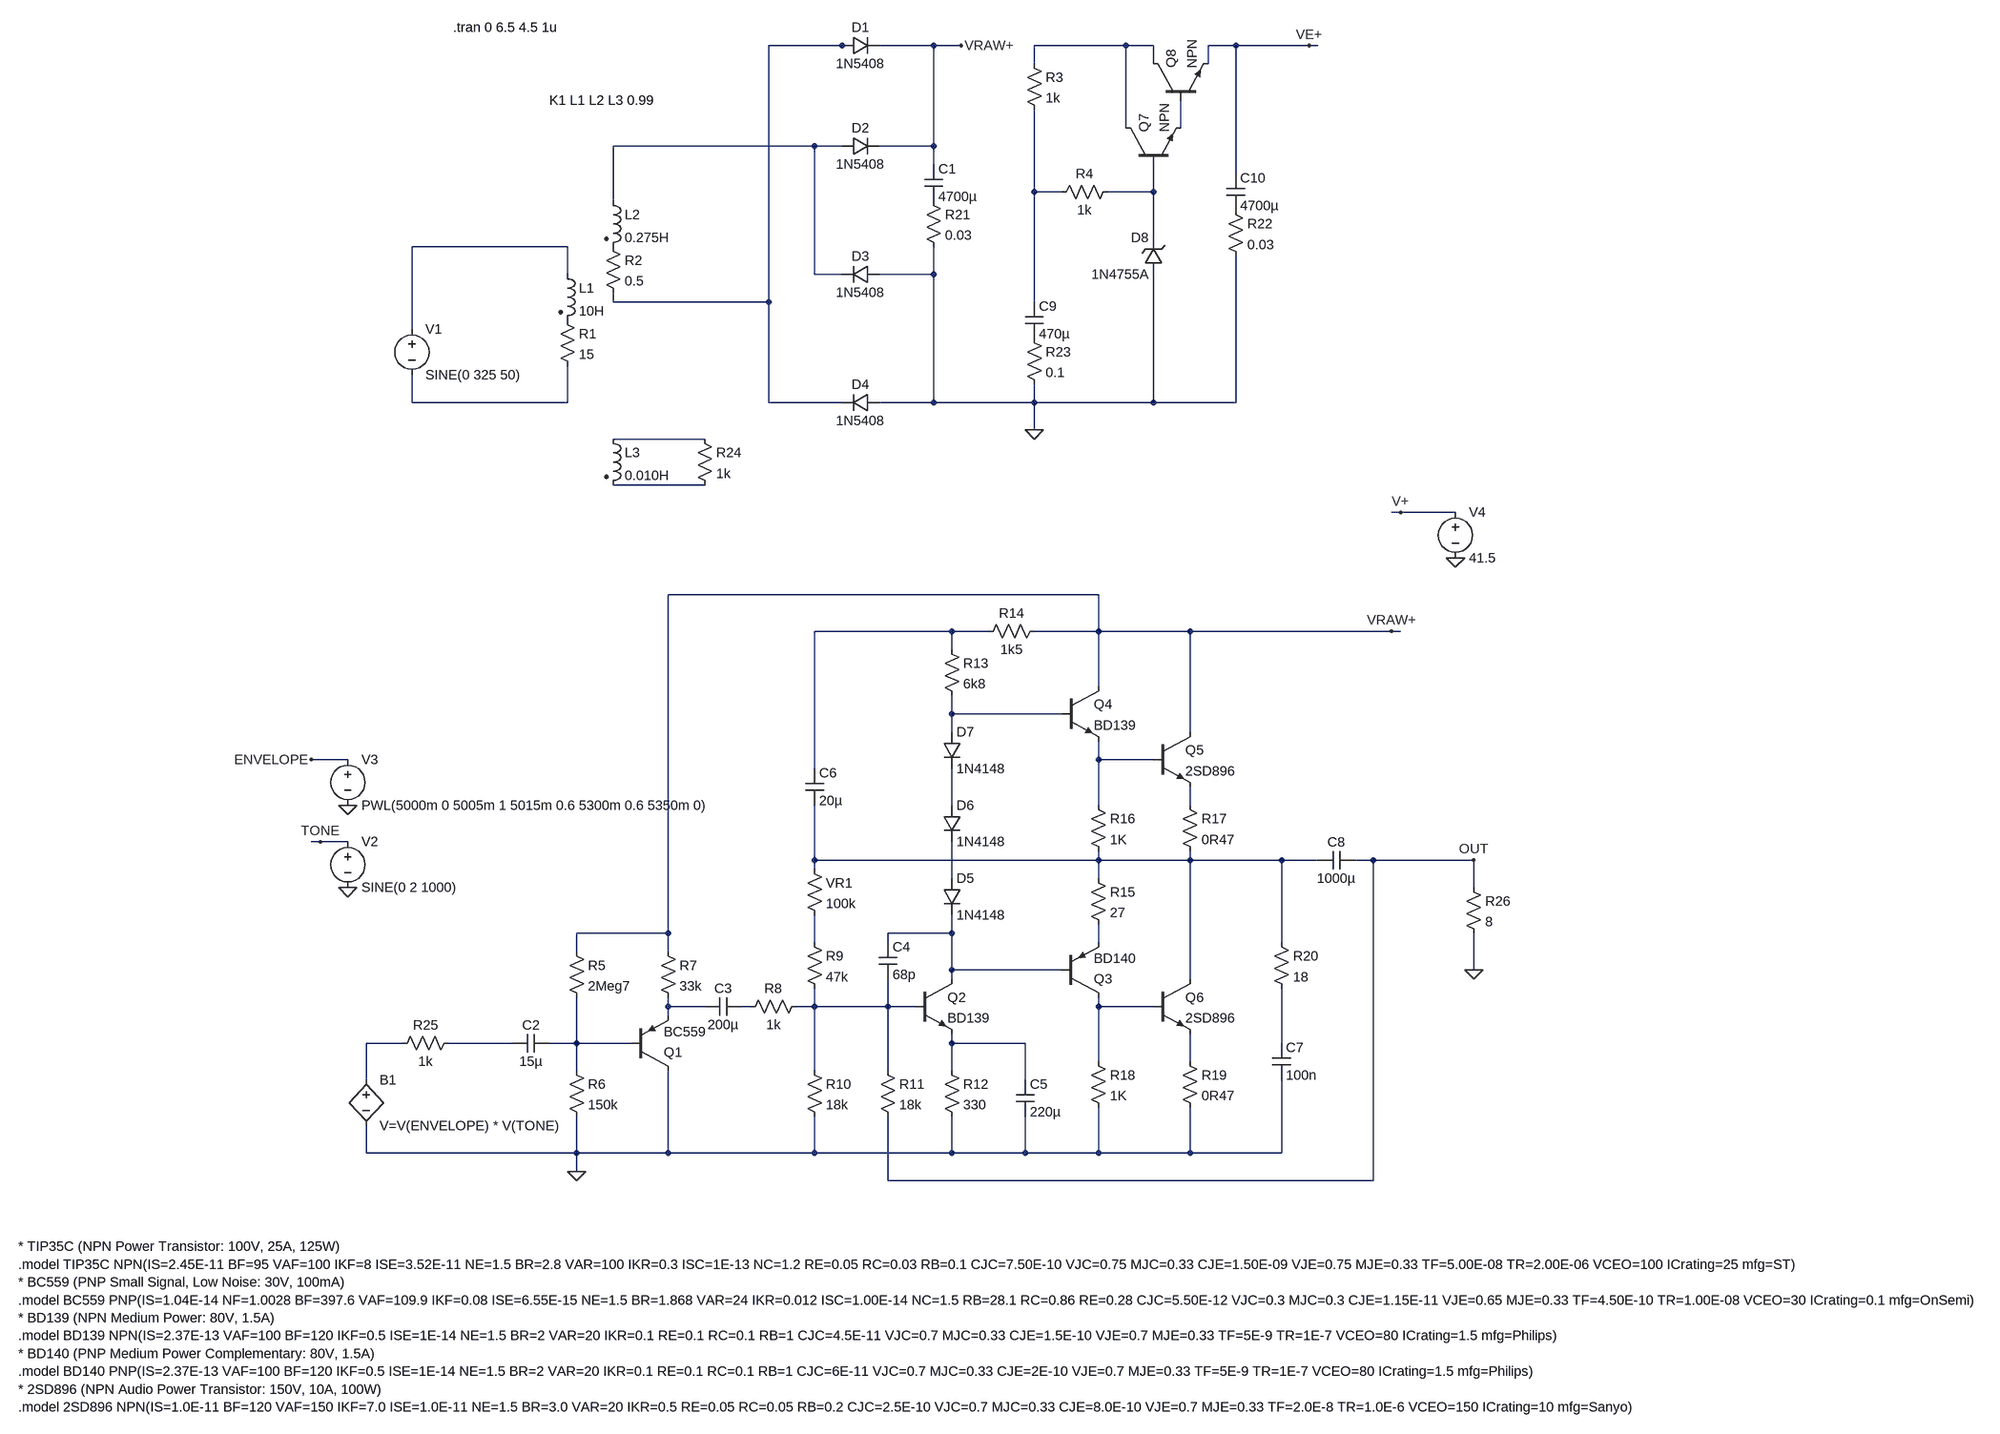
[diagram p0: schematic el_cheapo.asc]
el_cheapo.asc, the LTspice schematic file:
Version 4
SHEET 1 2784 2188
WIRE 832 -240 704 -240
WIRE 848 -240 832 -240
WIRE 992 -240 896 -240
WIRE 1040 -240 992 -240
WIRE 1328 -240 1168 -240
WIRE 1376 -240 1328 -240
WIRE 1520 -240 1472 -240
WIRE 1648 -240 1520 -240
WIRE 1664 -240 1648 -240
WIRE 1168 -208 1168 -240
WIRE 1376 -208 1376 -240
WIRE 1472 -208 1472 -240
WIRE 1328 -96 1328 -240
WIRE 1424 -96 1424 -144
WIRE 784 -64 432 -64
WIRE 832 -64 784 -64
WIRE 992 -64 992 -240
WIRE 992 -64 896 -64
WIRE 992 -32 992 -64
WIRE 1520 -16 1520 -240
WIRE 1168 16 1168 -128
WIRE 1216 16 1168 16
WIRE 1376 16 1376 -32
WIRE 1376 16 1296 16
WIRE 432 32 432 -64
WIRE 1376 96 1376 16
WIRE 352 112 80 112
WIRE 352 160 352 112
WIRE 784 160 784 -64
WIRE 832 160 784 160
WIRE 992 160 992 112
WIRE 992 160 896 160
WIRE 432 208 432 192
WIRE 704 208 704 -240
WIRE 704 208 432 208
WIRE 1168 208 1168 16
WIRE 80 256 80 112
WIRE 80 384 80 336
WIRE 352 384 352 320
WIRE 352 384 80 384
WIRE 704 384 704 208
WIRE 832 384 704 384
WIRE 992 384 992 160
WIRE 992 384 896 384
WIRE 1168 384 1168 352
WIRE 1168 384 992 384
WIRE 1376 384 1376 160
WIRE 1376 384 1168 384
WIRE 1520 384 1520 128
WIRE 1520 384 1376 384
WIRE 1168 432 1168 384
WIRE 592 448 432 448
WIRE 592 528 432 528
WIRE 1808 576 1792 576
WIRE 1904 576 1808 576
WIRE 1280 720 528 720
WIRE 1024 784 784 784
WIRE 1088 784 1024 784
WIRE 1280 784 1280 720
WIRE 1280 784 1168 784
WIRE 1440 784 1280 784
WIRE 1792 784 1440 784
WIRE 1808 784 1792 784
WIRE 1024 816 1024 784
WIRE 1280 880 1280 784
WIRE 1024 928 1024 896
WIRE 1216 928 1024 928
WIRE 1024 960 1024 928
WIRE 1440 960 1440 784
WIRE -32 1008 -96 1008
WIRE 1280 1008 1280 976
WIRE 1376 1008 1280 1008
WIRE 784 1024 784 784
WIRE 1024 1088 1024 1024
WIRE 1280 1088 1280 1008
WIRE 1440 1088 1440 1056
WIRE -80 1152 -96 1152
WIRE -32 1152 -80 1152
WIRE 784 1184 784 1088
WIRE 1280 1184 1280 1168
WIRE 1280 1184 784 1184
WIRE 1440 1184 1440 1168
WIRE 1440 1184 1280 1184
WIRE 1600 1184 1440 1184
WIRE 1664 1184 1600 1184
WIRE 1760 1184 1728 1184
WIRE 1936 1184 1760 1184
WIRE 784 1200 784 1184
WIRE 1024 1216 1024 1152
WIRE 1280 1216 1280 1184
WIRE 1936 1232 1936 1184
WIRE 528 1312 528 720
WIRE 528 1312 368 1312
WIRE 1024 1312 1024 1280
WIRE 1024 1312 912 1312
WIRE 784 1328 784 1280
WIRE 912 1328 912 1312
WIRE 1280 1328 1280 1296
WIRE 1600 1328 1600 1184
WIRE 368 1344 368 1312
WIRE 528 1344 528 1312
WIRE 1024 1376 1024 1312
WIRE 1216 1376 1024 1376
WIRE 1936 1376 1936 1312
WIRE 1024 1392 1024 1376
WIRE 1440 1392 1440 1184
WIRE 528 1440 528 1424
WIRE 592 1440 528 1440
WIRE 672 1440 656 1440
WIRE 784 1440 784 1408
WIRE 784 1440 752 1440
WIRE 912 1440 912 1392
WIRE 912 1440 784 1440
WIRE 960 1440 912 1440
WIRE 1280 1440 1280 1424
WIRE 1376 1440 1280 1440
WIRE 528 1456 528 1440
WIRE 64 1504 0 1504
WIRE 256 1504 144 1504
WIRE 368 1504 368 1424
WIRE 368 1504 320 1504
WIRE 464 1504 368 1504
WIRE 1024 1504 1024 1488
WIRE 1152 1504 1024 1504
WIRE 1600 1504 1600 1408
WIRE 1280 1536 1280 1440
WIRE 1440 1536 1440 1488
WIRE 368 1552 368 1504
WIRE 784 1552 784 1440
WIRE 912 1552 912 1440
WIRE 1024 1552 1024 1504
WIRE 0 1568 0 1504
WIRE 1152 1568 1152 1504
WIRE 0 1696 0 1648
WIRE 368 1696 368 1632
WIRE 368 1696 0 1696
WIRE 528 1696 528 1552
WIRE 528 1696 368 1696
WIRE 784 1696 784 1632
WIRE 784 1696 528 1696
WIRE 1024 1696 1024 1632
WIRE 1024 1696 784 1696
WIRE 1152 1696 1152 1632
WIRE 1152 1696 1024 1696
WIRE 1280 1696 1280 1616
WIRE 1280 1696 1152 1696
WIRE 1440 1696 1440 1616
WIRE 1440 1696 1280 1696
WIRE 1600 1696 1600 1568
WIRE 1600 1696 1440 1696
WIRE 368 1728 368 1696
WIRE 912 1744 912 1632
WIRE 1760 1744 1760 1184
WIRE 1760 1744 912 1744
FLAG 368 1728 0
FLAG 1792 784 VRAW+
FLAG 1168 432 0
FLAG 1648 -240 VE+
FLAG -32 1232 0
FLAG -32 1088 0
FLAG -96 1008 ENVELOPE
FLAG -80 1152 TONE
FLAG 1904 656 0
FLAG 1808 576 V+
FLAG 1936 1376 0
FLAG 1936 1184 OUT
FLAG 1040 -240 VRAW+
DATAFLAG 368 1504 "$"
DATAFLAG 1792 1184 "$"
SYMBOL voltage 80 240 R0
SYMATTR InstName V1
SYMATTR Value SINE(0 325 50)
SYMATTR SpiceLine Rser=0.1
SYMBOL ind2 336 144 R0
SYMATTR InstName L1
SYMATTR Value 10H
SYMATTR Type ind
SYMBOL ind2 416 16 R0
SYMATTR InstName L2
SYMATTR Value 0.275H
SYMATTR Type ind
SYMBOL ind2 416 432 R0
SYMATTR InstName L3
SYMATTR Value 0.010H
SYMATTR Type ind
SYMBOL Res 336 224 R0
SYMATTR InstName R1
SYMATTR Value 15
SYMBOL Res 416 96 R0
SYMATTR InstName R2
SYMATTR Value 0.5
SYMBOL Cap 320 1488 R90
WINDOW 0 0 32 VBottom 2
WINDOW 3 32 32 VTop 2
SYMATTR InstName C2
SYMATTR Value 15µ
SYMBOL Res 352 1328 R0
SYMATTR InstName R5
SYMATTR Value 2Meg7
SYMBOL Res 352 1536 R0
SYMATTR InstName R6
SYMATTR Value 150k
SYMBOL pnp 464 1552 M180
SYMATTR InstName Q1
SYMATTR Value BC559
SYMBOL Res 512 1328 R0
SYMATTR InstName R7
SYMATTR Value 33k
SYMBOL Cap 656 1424 R90
WINDOW 0 0 32 VBottom 2
WINDOW 3 32 32 VTop 2
SYMATTR InstName C3
SYMATTR Value 200µ
SYMBOL Res 768 1424 R90
WINDOW 0 0 56 VBottom 2
WINDOW 3 32 56 VTop 2
SYMATTR InstName R8
SYMATTR Value 1k
SYMBOL Res 768 1312 R0
SYMATTR InstName R9
SYMATTR Value 47k
SYMBOL Res 768 1536 R0
SYMATTR InstName R10
SYMATTR Value 18k
SYMBOL Res 768 1184 R0
SYMATTR InstName VR1
SYMATTR Value 100k
SYMBOL npn 960 1392 R0
SYMATTR InstName Q2
SYMATTR Value BD139
SYMBOL Cap 896 1328 R0
SYMATTR InstName C4
SYMATTR Value 68p
SYMBOL Res 896 1536 R0
SYMATTR InstName R11
SYMATTR Value 18k
SYMBOL Res 1008 1536 R0
SYMATTR InstName R12
SYMATTR Value 330
SYMBOL Cap 1136 1568 R0
SYMATTR InstName C5
SYMATTR Value 220µ
SYMBOL diode 1008 1216 R0
SYMATTR InstName D5
SYMATTR Value 1N4148
SYMBOL diode 1008 1088 R0
SYMATTR InstName D6
SYMATTR Value 1N4148
SYMBOL diode 1008 960 R0
SYMATTR InstName D7
SYMATTR Value 1N4148
SYMBOL Cap 768 1024 R0
SYMATTR InstName C6
SYMATTR Value 20µ
SYMBOL Res 1008 800 R0
SYMATTR InstName R13
SYMATTR Value 6k8
SYMBOL Res 1184 768 R90
WINDOW 0 0 56 VBottom 2
WINDOW 3 32 56 VTop 2
SYMATTR InstName R14
SYMATTR Value 1k5
SYMBOL Res 1264 1200 R0
SYMATTR InstName R15
SYMATTR Value 27
SYMBOL Res 1264 1072 R0
SYMATTR InstName R16
SYMATTR Value 1K
SYMBOL npn 1216 880 R0
SYMATTR InstName Q4
SYMATTR Value BD139
SYMBOL npn 1376 960 R0
SYMATTR InstName Q5
SYMATTR Value 2SD896
SYMBOL Res 1424 1072 R0
SYMATTR InstName R17
SYMATTR Value 0R47
SYMBOL Res 1264 1520 R0
SYMATTR InstName R18
SYMATTR Value 1K
SYMBOL npn 1376 1392 R0
SYMATTR InstName Q6
SYMATTR Value 2SD896
SYMBOL Res 1424 1520 R0
SYMATTR InstName R19
SYMATTR Value 0R47
SYMBOL Cap 1584 1504 R0
SYMATTR InstName C7
SYMATTR Value 100n
SYMBOL Res 1584 1312 R0
SYMATTR InstName R20
SYMATTR Value 18
SYMBOL Cap 1728 1168 R90
WINDOW 0 0 32 VBottom 2
WINDOW 3 32 32 VTop 2
SYMATTR InstName C8
SYMATTR Value 1000µ
SYMBOL Diode 832 -224 R270
WINDOW 0 32 32 VTop 2
WINDOW 3 0 32 VBottom 2
SYMATTR InstName D1
SYMATTR Value 1N5408
SYMBOL Diode 832 -48 R270
WINDOW 0 32 32 VTop 2
WINDOW 3 0 32 VBottom 2
SYMATTR InstName D2
SYMATTR Value 1N5408
SYMBOL Diode 896 144 R90
WINDOW 0 0 32 VBottom 2
WINDOW 3 32 32 VTop 2
SYMATTR InstName D3
SYMATTR Value 1N5408
SYMBOL Diode 896 368 R90
WINDOW 0 0 32 VBottom 2
WINDOW 3 32 32 VTop 2
SYMATTR InstName D4
SYMATTR Value 1N5408
SYMBOL Cap 976 -32 R0
SYMATTR InstName C1
SYMATTR Value 4700µ
SYMBOL Res 1152 -224 R0
SYMATTR InstName R3
SYMATTR Value 1k
SYMBOL Cap 1152 208 R0
SYMATTR InstName C9
SYMATTR Value 470µ
SYMBOL Res 1312 0 R90
WINDOW 0 0 56 VBottom 2
WINDOW 3 32 56 VTop 2
SYMATTR InstName R4
SYMATTR Value 1k
SYMBOL npn 1328 -32 R270
SYMATTR InstName Q7
SYMBOL npn 1376 -144 R270
SYMATTR InstName Q8
SYMBOL Cap 1504 -16 R0
SYMATTR InstName C10
SYMATTR Value 4700µ
SYMBOL Res 976 16 R0
SYMATTR InstName R21
SYMATTR Value 0.03
SYMBOL Res 1504 32 R0
SYMATTR InstName R22
SYMATTR Value 0.03
SYMBOL Res 1152 256 R0
SYMATTR InstName R23
SYMATTR Value 0.1
SYMBOL zener 1392 160 R180
WINDOW 0 24 64 Left 2
WINDOW 3 24 0 Left 2
SYMATTR InstName D8
SYMATTR Value 1N4755A
SYMBOL Res 576 432 R0
SYMATTR InstName R24
SYMATTR Value 1k
SYMBOL voltage -32 1136 R0
SYMATTR InstName V2
SYMATTR Value SINE(0 2 1000)
SYMBOL voltage -32 992 R0
SYMATTR InstName V3
SYMATTR Value PWL(5000m 0 5005m 1 5015m 0.6 5300m 0.6 5350m 0)
SYMBOL bv 0 1552 R0
SYMATTR InstName B1
SYMATTR Value V=V(ENVELOPE) * V(TONE)
SYMBOL Res 160 1488 R90
WINDOW 0 0 56 VBottom 2
WINDOW 3 32 56 VTop 2
SYMATTR InstName R25
SYMATTR Value 1k
SYMBOL pnp 1216 1424 M180
SYMATTR InstName Q3
SYMATTR Value BD140
SYMBOL voltage 1904 560 R0
SYMATTR InstName V4
SYMATTR Value 41.5
SYMBOL Res 1920 1216 R0
SYMATTR InstName R26
SYMATTR Value 8
TEXT 320 -144 Left 2 !K1 L1 L2 L3 0.99
TEXT 152 -272 Left 2 !.tran 0 6.5 4.5 1u
TEXT -608 1976 Left 2 !* TIP35C (NPN Power Transistor: 100V, 25A, 125W)\n.model TIP35C NPN(IS=2.45E-11 BF=95 VAF=100 IKF=8 ISE=3.52E-11 NE=1.5 BR=2.8 VAR=100 IKR=0.3 ISC=1E-13 NC=1.2 RE=0.05 RC=0.03 RB=0.1 CJC=7.50E-10 VJC=0.75 MJC=0.33 CJE=1.50E-09 VJE=0.75 MJE=0.33 TF=5.00E-08 TR=2.00E-06 VCEO=100 ICrating=25 mfg=ST)\n* BC559 (PNP Small Signal, Low Noise: 30V, 100mA)\n.model BC559 PNP(IS=1.04E-14 NF=1.0028 BF=397.6 VAF=109.9 IKF=0.08 ISE=6.55E-15 NE=1.5 BR=1.868 VAR=24 IKR=0.012 ISC=1.00E-14 NC=1.5 RB=28.1 RC=0.86 RE=0.28 CJC=5.50E-12 VJC=0.3 MJC=0.3 CJE=1.15E-11 VJE=0.65 MJE=0.33 TF=4.50E-10 TR=1.00E-08 VCEO=30 ICrating=0.1 mfg=OnSemi)\n* BD139 (NPN Medium Power: 80V, 1.5A)\n.model BD139 NPN(IS=2.37E-13 VAF=100 BF=120 IKF=0.5 ISE=1E-14 NE=1.5 BR=2 VAR=20 IKR=0.1 RE=0.1 RC=0.1 RB=1 CJC=4.5E-11 VJC=0.7 MJC=0.33 CJE=1.5E-10 VJE=0.7 MJE=0.33 TF=5E-9 TR=1E-7 VCEO=80 ICrating=1.5 mfg=Philips)\n* BD140 (PNP Medium Power Complementary: 80V, 1.5A)\n.model BD140 PNP(IS=2.37E-13 VAF=100 BF=120 IKF=0.5 ISE=1E-14 NE=1.5 BR=2 VAR=20 IKR=0.1 RE=0.1 RC=0.1 RB=1 CJC=6E-11 VJC=0.7 MJC=0.33 CJE=2E-10 VJE=0.7 MJE=0.33 TF=5E-9 TR=1E-7 VCEO=80 ICrating=1.5 mfg=Philips)\n* 2SD896 (NPN Audio Power Transistor: 150V, 10A, 100W)\n.model 2SD896 NPN(IS=1.0E-11 BF=120 VAF=150 IKF=7.0 ISE=1.0E-11 NE=1.5 BR=3.0 VAR=20 IKR=0.5 RE=0.05 RC=0.05 RB=0.2 CJC=2.5E-10 VJC=0.7 MJC=0.33 CJE=8.0E-10 VJE=0.7 MJE=0.33 TF=2.0E-8 TR=1.0E-6 VCEO=150 ICrating=10 mfg=Sanyo)

The netlist it stands for:
* el_cheapo.asc
V1 N007 N008 SINE(0 325 50) Rser=0.1
L1 N007 P001 10H
L2 N004 P002 0.275H
L3 N009 N010 0.010H
R1 P001 N008 15
R2 P002 N001 0.5
C2 N027 N026 15µ
R5 VRAW+ N027 2Meg7
R6 N027 0 150k
Q1 0 N027 N021 0 BC559
R7 VRAW+ N021 33k
C3 N022 N021 200µ
R8 N023 N022 1k
R9 N019 N023 47k
R10 N023 0 18k
R§VR1 N016 N019 100k
Q2 N018 N023 N028 0 BD139
C4 N018 N023 68p
R11 N023 OUT 18k
R12 N028 0 330
C5 N028 0 220µ
D5 N017 N018 1N4148
D6 N014 N017 1N4148
D7 N012 N014 1N4148
C6 N011 N016 20µ
R13 N011 N012 6k8
R14 VRAW+ N011 1k5
R15 N016 N020 27
R16 N013 N016 1K
Q4 VRAW+ N012 N013 0 BD139
Q5 VRAW+ N013 N015 0 2SD896
R17 N015 N016 0R47
R18 N024 0 1K
Q6 N016 N024 N030 0 2SD896
R19 N030 0 0R47
C7 N029 0 100n
R20 N016 N029 18
C8 OUT N016 1000µ
D1 N001 VRAW+ 1N5408
D2 N004 VRAW+ 1N5408
D3 0 N004 1N5408
D4 0 N001 1N5408
C1 VRAW+ P003 4700µ
R3 N002 N005 1k
C9 N005 P004 470µ
R4 N006 N005 1k
Q7 N002 N006 N003 0 NPN
Q8 N002 N003 VE+ 0 NPN
C10 VE+ P005 4700µ
R21 P003 0 0.03
R22 P005 0 0.03
R23 P004 0 0.1
D8 0 N006 1N4755A
R24 N009 N010 1k
V2 TONE 0 SINE(0 2 1000)
V3 ENVELOPE 0 PWL(5000m 0 5005m 1 5015m 0.6 5300m 0.6 5350m 0)
B1 N025 0 V=V(ENVELOPE) * V(TONE)
R25 N026 N025 1k
Q3 N024 N018 N020 0 BD140
V4 V+ 0 41.5
R26 OUT 0 8
.model D D
.lib standard.dio
.model NPN NPN
.model PNP PNP
.lib standard.bjt
K1 L1 L2 L3 0.99
.tran 0 6.5 4.5 1u
* TIP35C (NPN Power Transistor: 100V, 25A, 125W)
.model TIP35C NPN(IS=2.45E-11 BF=95 VAF=100 IKF=8 ISE=3.52E-11 NE=1.5 BR=2.8 VAR=100 IKR=0.3 ISC=1E-13 NC=1.2 RE=0.05 RC=0.03 RB=0.1 CJC=7.50E-10 VJC=0.75 MJC=0.33 CJE=1.50E-09 VJE=0.75 MJE=0.33 TF=5.00E-08 TR=2.00E-06 VCEO=100 ICrating=25 mfg=ST)
* BC559 (PNP Small Signal, Low Noise: 30V, 100mA)
.model BC559 PNP(IS=1.04E-14 NF=1.0028 BF=397.6 VAF=109.9 IKF=0.08 ISE=6.55E-15 NE=1.5 BR=1.868 VAR=24 IKR=0.012 ISC=1.00E-14 NC=1.5 RB=28.1 RC=0.86 RE=0.28 CJC=5.50E-12 VJC=0.3 MJC=0.3 CJE=1.15E-11 VJE=0.65 MJE=0.33 TF=4.50E-10 TR=1.00E-08 VCEO=30 ICrating=0.1 mfg=OnSemi)
* BD139 (NPN Medium Power: 80V, 1.5A)
.model BD139 NPN(IS=2.37E-13 VAF=100 BF=120 IKF=0.5 ISE=1E-14 NE=1.5 BR=2 VAR=20 IKR=0.1 RE=0.1 RC=0.1 RB=1 CJC=4.5E-11 VJC=0.7 MJC=0.33 CJE=1.5E-10 VJE=0.7 MJE=0.33 TF=5E-9 TR=1E-7 VCEO=80 ICrating=1.5 mfg=Philips)
* BD140 (PNP Medium Power Complementary: 80V, 1.5A)
.model BD140 PNP(IS=2.37E-13 VAF=100 BF=120 IKF=0.5 ISE=1E-14 NE=1.5 BR=2 VAR=20 IKR=0.1 RE=0.1 RC=0.1 RB=1 CJC=6E-11 VJC=0.7 MJC=0.33 CJE=2E-10 VJE=0.7 MJE=0.33 TF=5E-9 TR=1E-7 VCEO=80 ICrating=1.5 mfg=Philips)
* 2SD896 (NPN Audio Power Transistor: 150V, 10A, 100W)
.model 2SD896 NPN(IS=1.0E-11 BF=120 VAF=150 IKF=7.0 ISE=1.0E-11 NE=1.5 BR=3.0 VAR=20 IKR=0.5 RE=0.05 RC=0.05 RB=0.2 CJC=2.5E-10 VJC=0.7 MJC=0.33 CJE=8.0E-10 VJE=0.7 MJE=0.33 TF=2.0E-8 TR=1.0E-6 VCEO=150 ICrating=10 mfg=Sanyo)
.backanno
.end